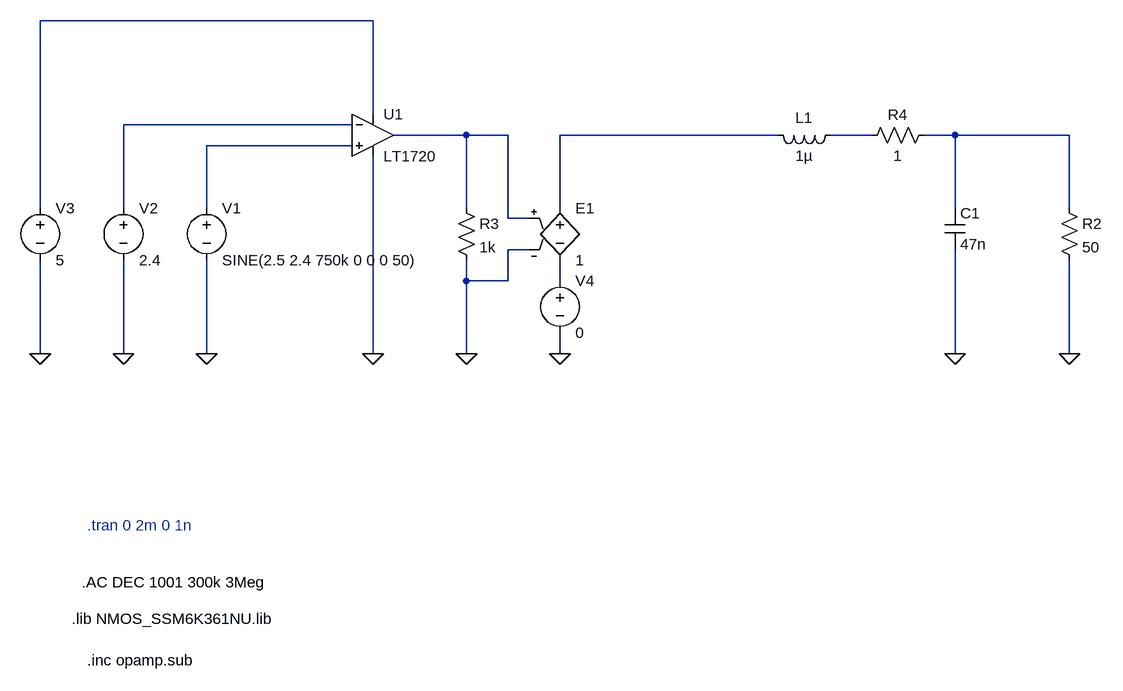
[diagram p0: schematic OutputGen.asc]
OutputGen.asc, the LTspice schematic file:
Version 4
SHEET 1 1236 1208
WIRE -288 208 -800 208
WIRE -288 352 -288 208
WIRE -320 368 -672 368
WIRE -144 384 -256 384
WIRE -80 384 -144 384
WIRE 336 384 0 384
WIRE 480 384 416 384
WIRE 608 384 560 384
WIRE 784 384 608 384
WIRE -320 400 -544 400
WIRE -800 496 -800 208
WIRE -672 496 -672 368
WIRE -544 496 -544 400
WIRE -144 496 -144 384
WIRE 0 496 0 384
WIRE 608 496 608 384
WIRE 784 496 784 384
WIRE -80 512 -80 384
WIRE -48 512 -80 512
WIRE -48 560 -80 560
WIRE -144 608 -144 576
WIRE -80 608 -80 560
WIRE -80 608 -144 608
WIRE 0 608 0 576
WIRE -800 720 -800 576
WIRE -672 720 -672 576
WIRE -544 720 -544 576
WIRE -288 720 -288 416
WIRE -144 720 -144 608
WIRE 0 720 0 688
WIRE 608 720 608 560
WIRE 784 720 784 576
FLAG 608 720 0
FLAG -544 720 0
FLAG -800 720 0
FLAG 784 720 0
FLAG -672 720 0
FLAG -288 720 0
FLAG -144 720 0
FLAG 0 720 0
SYMBOL voltage -800 480 R0
SYMATTR InstName V3
SYMATTR Value 5
SYMBOL res 768 480 R0
SYMATTR InstName R2
SYMATTR Value 50
SYMBOL ind 432 368 R90
WINDOW 0 5 56 VBottom 2
WINDOW 3 32 56 VTop 2
SYMATTR InstName L1
SYMATTR Value 1µ
SYMATTR SpiceLine Ipk=1.8 Rser=80m Rpar=1.62K Cpar=886f mfg="Bourns, Inc." pn="SRN2010TA-1R0Y"
SYMBOL cap 592 496 R0
SYMATTR InstName C1
SYMATTR Value 47n
SYMATTR SpiceLine Rser=76.6m Lser=0 mfg="   ---" pn="   ---" type="   ---"
SYMBOL voltage -544 480 R0
SYMATTR InstName V1
SYMATTR Value SINE(2.5 2.4 750k 0 0 0 50)
SYMBOL voltage -672 480 R0
SYMATTR InstName V2
SYMATTR Value 2.4
SYMBOL Comparators/LT1720 -288 320 R0
SYMATTR InstName U1
SYMBOL res -160 480 R0
SYMATTR InstName R3
SYMATTR Value 1k
SYMBOL e 0 480 R0
SYMATTR InstName E1
SYMATTR Value 1
SYMATTR SpiceModel 1
SYMBOL res 576 368 R90
WINDOW 0 0 56 VBottom 2
WINDOW 3 32 56 VTop 2
SYMATTR InstName R4
SYMATTR Value 1
SYMBOL voltage 0 592 R0
SYMATTR InstName V4
SYMATTR Value 0
SYMATTR Value2 AC 1 0
TEXT -736 1072 Left 2 !.AC DEC 1001 300k 3Meg
TEXT -752 1128 Left 2 !.lib NMOS_SSM6K361NU.lib
TEXT -728 984 Left 2 ;.tran 0 2m 0 1n
TEXT -728 1192 Left 2 !.inc opamp.sub

The netlist it stands for:
* OutputGen.asc
V3 N001 0 5
R2 N006 0 50
L1 N005 N004 1µ Ipk=1.8 Rser=80m Rpar=1.62K Cpar=886f mfg="Bourns, Inc." pn="SRN2010TA-1R0Y"
C1 N006 0 47n Rser=76.6m Lser=0 mfg="   ---" pn="   ---" type="   ---"
V1 N007 0 SINE(2.5 2.4 750k 0 0 0 50)
V2 N002 0 2.4
XU1 N007 N002 N001 0 N003 LT1720  ; pins In+ In- V+ V- OUT
R3 N003 0 1k
E1 N004 N008 N003 0 1 1
R4 N006 N005 1
V4 N008 0 0 AC 1 0
.AC DEC 1001 300k 3Meg
.lib NMOS_SSM6K361NU.lib
* .tran 0 2m 0 1n
.inc opamp.sub
.lib LT1720.sub
.backanno
.end